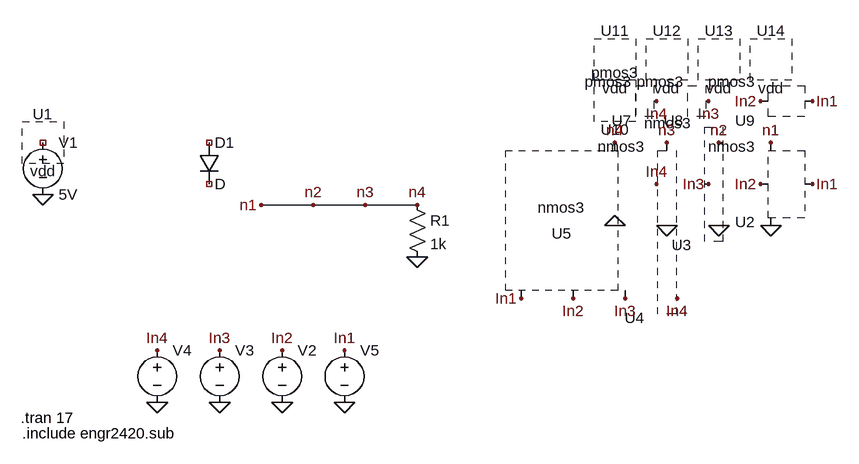
[diagram p0: schematic dac-v2.asc]
dac-v2.asc, the LTspice schematic file:
Version 4
SHEET 1 1176 680
WIRE 352 256 272 256
WIRE 432 256 352 256
WIRE 512 256 432 256
FLAG 1056 288 0
FLAG 976 288 0
FLAG 896 288 0
FLAG 816 288 0
FLAG -64 240 0
FLAG 1120 224 In1
FLAG 1040 224 In2
FLAG 960 224 In3
FLAG 880 224 In4
FLAG 400 480 In1
FLAG 112 560 0
FLAG 304 480 In2
FLAG 208 560 0
FLAG 208 480 In3
FLAG 304 560 0
FLAG 112 480 In4
FLAG 400 560 0
FLAG 880 96 In4
FLAG 960 96 In3
FLAG 1040 96 In2
FLAG 1120 96 In1
FLAG 1056 160 n1
FLAG 976 160 n2
FLAG 896 160 n3
FLAG 816 160 n4
FLAG 272 256 n1
FLAG 352 256 n2
FLAG 432 256 n3
FLAG 512 256 n4
FLAG 672 400 In1
FLAG 752 400 In2
FLAG 832 400 In3
FLAG 912 400 In4
FLAG 512 336 0
SYMBOL cktsym\\nmos3 1056 224 R180
SYMATTR InstName U2
SYMBOL cktsym\\nmos3 976 224 R180
SYMATTR InstName U3
SYMBOL cktsym\\nmos3 896 224 R180
SYMATTR InstName U4
SYMBOL cktsym\\nmos3 816 224 R180
SYMATTR InstName U5
SYMBOL cktsym\\vdd -64 160 R0
SYMATTR InstName U1
SYMBOL voltage -64 144 R0
WINDOW 123 0 0 Left 0
WINDOW 39 0 0 Left 0
SYMATTR InstName V1
SYMATTR Value 5V
SYMBOL voltage 400 464 R0
WINDOW 3 24 44 Invisible 2
WINDOW 123 0 0 Left 0
WINDOW 39 0 0 Left 0
SYMATTR InstName V5
SYMATTR Value PULSE(0 1 0 0.01 0.01 8 16 1)
SYMBOL voltage 304 464 R0
WINDOW 3 24 44 Invisible 2
WINDOW 123 0 0 Left 0
WINDOW 39 0 0 Left 0
SYMATTR InstName V2
SYMATTR Value PULSE(0 1 0 0.01 0.01 4 8 2)
SYMBOL voltage 208 464 R0
WINDOW 3 24 44 Invisible 2
WINDOW 123 0 0 Left 0
WINDOW 39 0 0 Left 0
SYMATTR InstName V3
SYMATTR Value PULSE(0 1 0 0.01 0.01 2 4 4)
SYMBOL voltage 112 464 R0
WINDOW 3 24 44 Invisible 2
WINDOW 123 0 0 Left 0
WINDOW 39 0 0 Left 0
SYMATTR InstName V4
SYMATTR Value PULSE(0 1 0 0.01 0.01 1 2 8)
SYMBOL cktsym\\pmos3 896 96 R180
SYMATTR InstName U7
SYMBOL cktsym\\pmos3 976 96 R180
SYMATTR InstName U8
SYMBOL cktsym\\pmos3 1056 96 R180
SYMATTR InstName U9
SYMBOL cktsym\\pmos3 816 96 R180
SYMATTR InstName U10
SYMBOL cktsym\\vdd 816 32 R0
SYMATTR InstName U11
SYMBOL cktsym\\vdd 896 32 R0
SYMATTR InstName U12
SYMBOL cktsym\\vdd 976 32 R0
SYMATTR InstName U13
SYMBOL cktsym\\vdd 1056 32 R0
SYMATTR InstName U14
SYMBOL diode 176 160 R0
SYMATTR InstName D1
SYMBOL res 496 240 R0
SYMATTR InstName R1
SYMATTR Value 1k
TEXT -98 584 Left 2 !.tran 17
TEXT -96 608 Left 2 !.include engr2420.sub

The netlist it stands for:
* dac-v2.asc
* U2: nmos3 (symbol cktsym\nmos3 not available, pin order unknown); nets seen at it: 0, In1, In2, n4
* U3: nmos3 (symbol cktsym\nmos3 not available, pin order unknown); nets seen at it: 0, In3, n4
* U4: nmos3 (symbol cktsym\nmos3 not available, pin order unknown); nets seen at it: 0, In4, n4
* U5: nmos3 (symbol cktsym\nmos3 not available, pin order unknown); nets seen at it: 0, In1, In2, In3, n4
* U1: vdd (symbol cktsym\vdd not available, pin order unknown); nets seen at it: 
V1 NC_01 0 5V
V5 In1 0 PULSE(0 1 0 0.01 0.01 8 16 1)
V2 In2 0 PULSE(0 1 0 0.01 0.01 4 8 2)
V3 In3 0 PULSE(0 1 0 0.01 0.01 2 4 4)
V4 In4 0 PULSE(0 1 0 0.01 0.01 1 2 8)
* U7: pmos3 (symbol cktsym\pmos3 not available, pin order unknown); nets seen at it: In4
* U8: pmos3 (symbol cktsym\pmos3 not available, pin order unknown); nets seen at it: In3
* U9: pmos3 (symbol cktsym\pmos3 not available, pin order unknown); nets seen at it: In1, In2
* U10: pmos3 (symbol cktsym\pmos3 not available, pin order unknown); nets seen at it: 
* U11: vdd (symbol cktsym\vdd not available, pin order unknown); nets seen at it: 
* U12: vdd (symbol cktsym\vdd not available, pin order unknown); nets seen at it: 
* U13: vdd (symbol cktsym\vdd not available, pin order unknown); nets seen at it: 
* U14: vdd (symbol cktsym\vdd not available, pin order unknown); nets seen at it: 
D1 NC_02 NC_03 D
R1 n4 0 1k
.model D D
.lib standard.dio
.tran 17
.include engr2420.sub
.backanno
.end